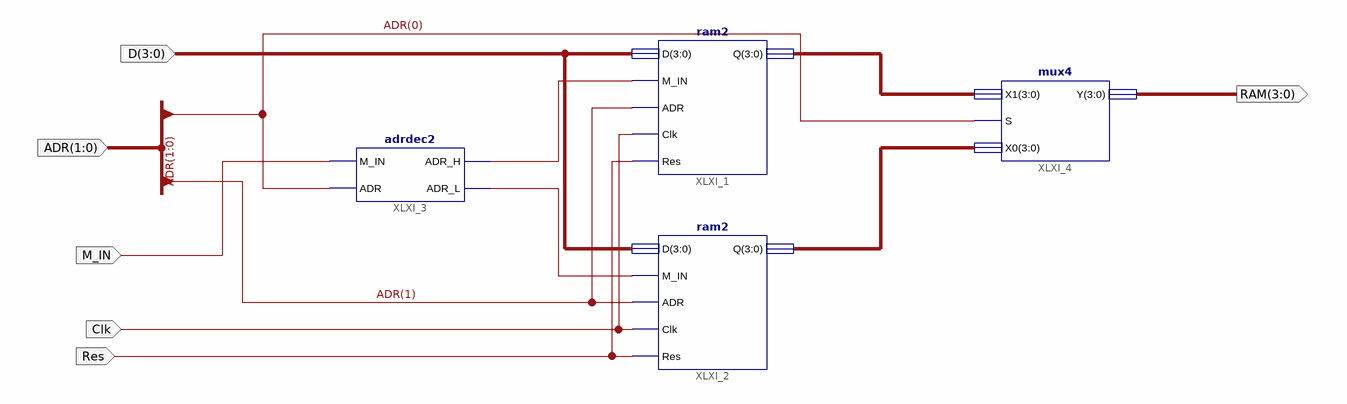
[diagram p0: schematic sheet 1]
// Xilinx ISE schematic ram4.sch (spartan3e) as structural Verilog: 4 symbols, 6 ports
module ram4 (
  input  [3:0] D,
  input  Clk,
  input  Res,
  input  [1:0] ADR,
  input  M_IN,
  output [3:0] RAM
);

  wire XLXN_21, XLXN_22;
  wire [3:0] XLXN_3, XLXN_4;

  ram2 XLXI_1 (.ADR(ADR[1]), .Clk(Clk), .D(D), .M_IN(XLXN_21), .Q(XLXN_3), .Res(Res));
  ram2 XLXI_2 (.ADR(ADR[1]), .Clk(Clk), .D(D), .M_IN(XLXN_22), .Q(XLXN_4), .Res(Res));
  adrdec2 XLXI_3 (.ADR(ADR[0]), .ADR_H(XLXN_21), .ADR_L(XLXN_22), .M_IN(M_IN));
  mux4 XLXI_4 (.S(ADR[0]), .X0(XLXN_4), .X1(XLXN_3), .Y(RAM));
endmodule
